# Altium schematic sheet differential_lowpass.SchDoc: Differential low-pass filter
size A4
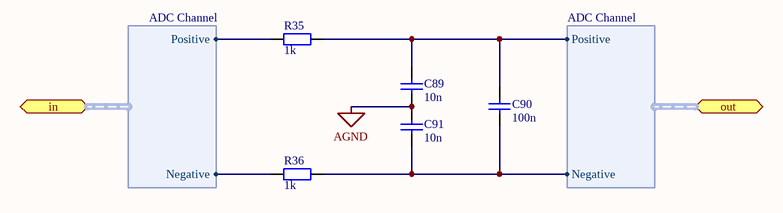
[diagram p0: differential_lowpass.SchDoc]

## Parts
C89  10n  [C0603]
C90  100n  [C0603]
C91  10n  [C0603]
R35  1k  [0603]
R36  1k  [0603]

## Ports
in (harness ADC Channel), out (harness ADC Channel)

## Harnesses
ADC Channel: Positive, Negative

## Nets
AGND: C89.2 C91.1
NetC89_1: C89.1 C90.1 R35.2 ; port out.Positive
NetC90_2: C90.2 C91.2 R36.2 ; port out.Negative
NetR35_1: R35.1 ; port in.Positive
NetR36_1: R36.1 ; port in.Negative

## Notes on the sheet
- Title:
- Sheet:
- of
- Author:
- Model:
- Document Number:
- Checked by:
- Iss-Rev:
- Approved by:
- Date:
- File name:

## Library data of the parts
C89-C91 = Cap: Generic capacitor
  C89 C91: value: 10n
  C90: value: 100n
R35 R36 = Res: Generic resistor; value: 1k